# Altium project pikobasic_new.PrjPcb
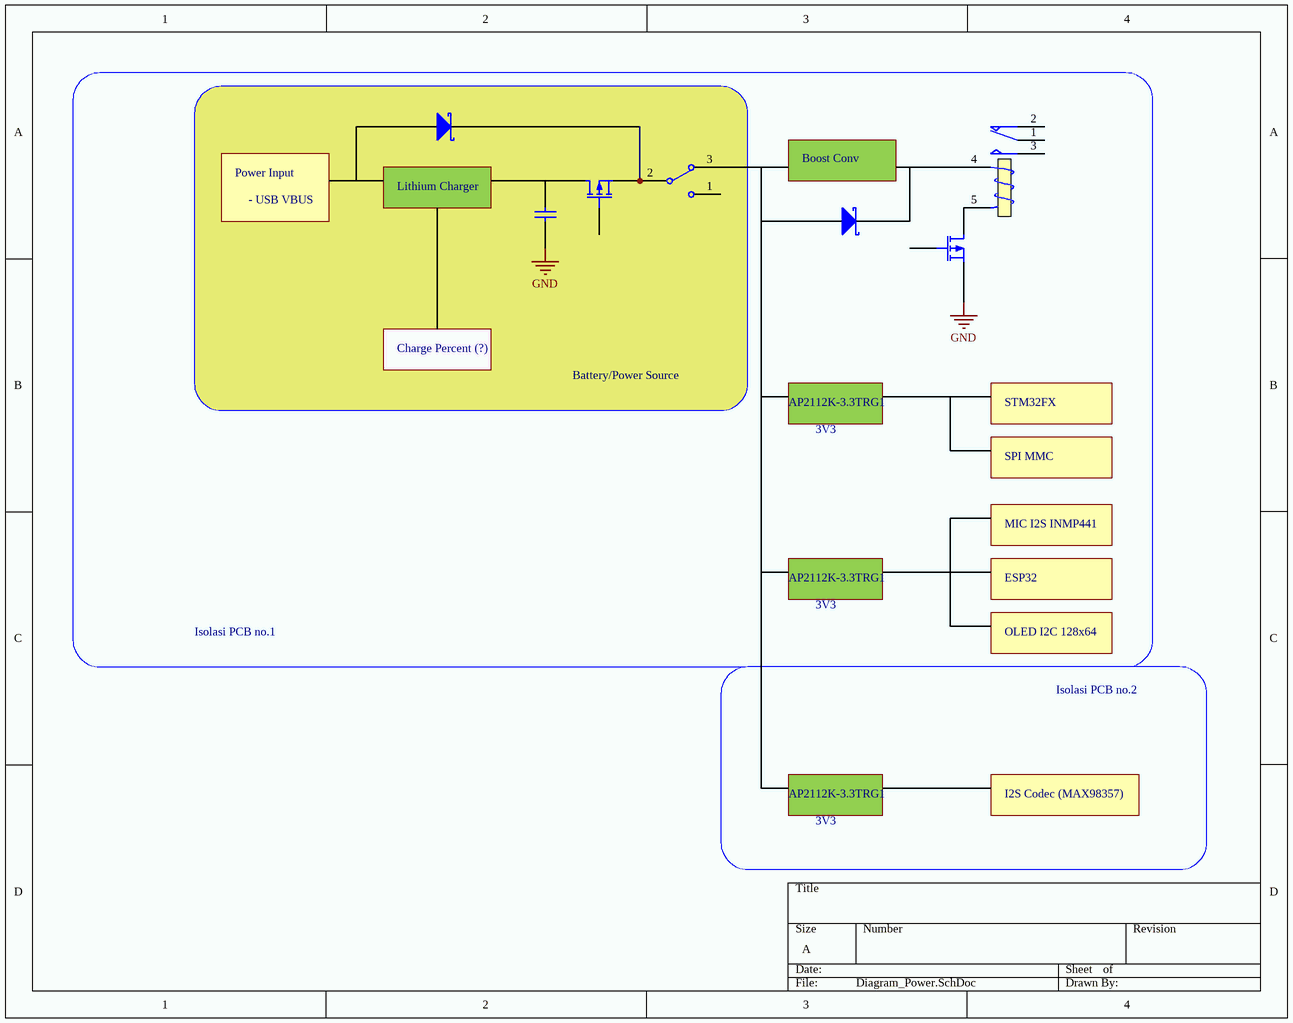
[diagram p0: Diagram_Power.SchDoc]
6 sheets, 186 parts. Net scope: global (net labels, ports and power ports of the same name join across sheets).
Sheets:
  Diagram_Power.SchDoc
  Diagram_Signal.SchDoc
  ESP32_EDITED.SchDoc
  STM32_EDITED.SchDoc
  DAC.SchDoc
  POWER_RAIL.SchDoc

## Sheet Diagram_Power.SchDoc
size A

### Parts
1  (no value)
2  (no value)
3  (no value)
4  (no value)
5  (no value)
7  (no value)
?  (no value)

### Nets
Net1_5: 1.5(T2) 5.1(D)
Net2_3: 2.3(S) 7.2

Not connected (* = marked no-connect by the designer): 1 1(COM) 2(NC) 3(NO) 4(T1); 2 1(D) 2(G); 3 1(A) 2(K); 4 1 2; 5 2(G) 3(S); 7 1 3; ? 1(A) 2(K)

### Notes on the sheet
- Boost Conv
- Power Input
- - USB VBUS
- Lithium Charger
- Charge Percent (?)
- Battery/Power Source
- AP2112K-3.3TRG1
- 3V3
- STM32FX
- SPI MMC
- MIC I2S INMP441
- Isolasi PCB no.1
- OLED I2C 128x64
- ESP32
- Isolasi PCB no.2
- I2S Codec (MAX98357)
- Labels drawn without touching a wire or pin: GND

### Library data of the parts
1 = Relay: Published: 8-Jun-2000; LatestRevisionDate: 17-Jul-2002; LatestRevisionNote: Re-released for DXP Platform.; PackageReference: MODULE5B; Publisher: Altium Limited
2 5 = MOSFET-P: P-Channel MOSFET; Published: 8-Jun-2000; LatestRevisionDate: 17-Jul-2002; LatestRevisionNote: Re-released for DXP Platform.; PackageVersion: 1995/1996; PackageReference: E3; Publisher: Altium Limited; PackageDescription: TO, Flat Index; 3 In-Line, Axial Leads; Body Dia. 4.6mm; Lead Dia. 0.5 mm (max)
3 ? = D Schottky: Schottky Diode; Published: 8-Jun-2000; LatestRevisionDate: 17-Jul-2002; LatestRevisionNote: Re-released for DXP Platform.; PackageReference: SMB; Publisher: Altium Limited; PackageDescription: DO-214-AA/SMB; 2 C-Bend Leads; Body 5.3 x 3.6 mm, inc. leads (LxW); Code_JEDEC: DO-214-AA
4 = Cap: Capacitor; Published: 8-Jun-2000; LatestRevisionDate: 17-Jul-2002; LatestRevisionNote: Re-released for DXP Platform.; PackageReference: RAD-0.3; Publisher: Altium Limited; PackageDescription: Radial Cap, Thru-Hole; 2 Leads; 0.3 in Pin Spacing
7 = SW-SPDT: SPDT Subminiature Toggle Switch, Right Angle Mounting, Vertical Actuation; Published: 24-Mar-1999; LatestRevisionDate: 17-Dec-2003; LatestRevisionNote: Schematic revised, PCB Footprint replaced.; DatasheetVersion: 05-Dec-2000; PackageReference: TL36WW15050; Publisher: Altium Limited; PackageDescription: Switch; 4 Leads; ComponentLink1Description: Manufacturer Link; ComponentLink1URL: http://www.apem.com

## Sheet Diagram_Signal.SchDoc
size A
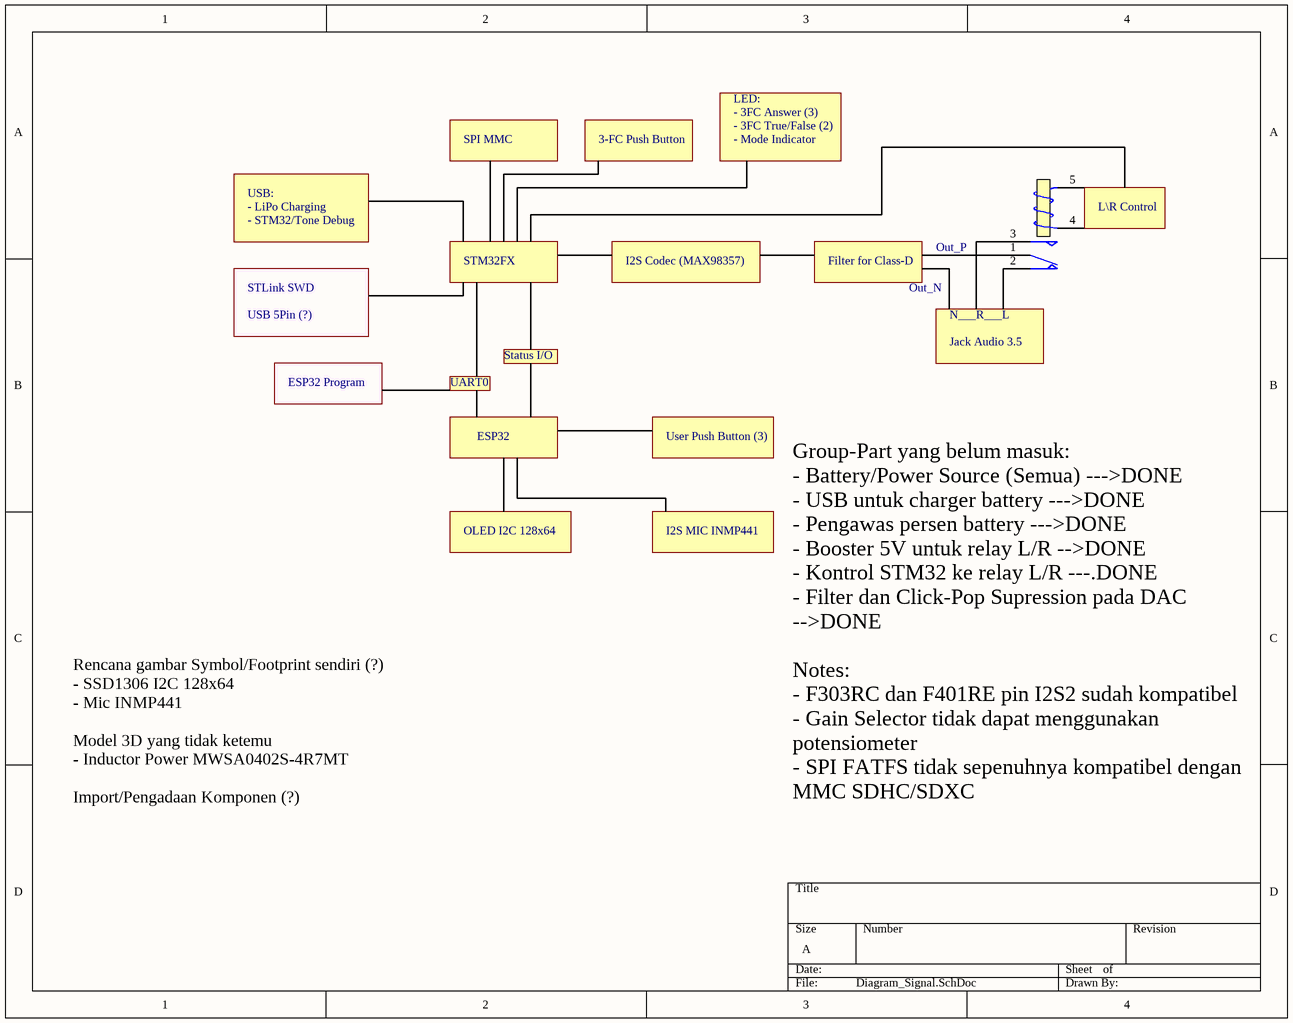
[diagram p1: Diagram_Signal.SchDoc]

### Parts
6  (no value)

### Nets

Not connected (* = marked no-connect by the designer): 6 1(COM) 2(NC) 3(NO) 4(T1) 5(T2)

### Notes on the sheet
- LED:
- SPI MMC
- 3-FC Push Button
- - 3FC Answer (3)
- - 3FC True/False (2)
- - Mode Indicator
- USB:
- - LiPo Charging
- - STM32/Tone Debug
- (near 6) L\R Control
- STLink SWD
- STM32FX
- I2S Codec (MAX98357)
- Filter for Class-D
- Out_N
- Out_P
- USB 5Pin (?)
- Status I/O
- Jack Audio 3.5
- (near 6) N___R___L
- ESP32 Program
- UART0
- ESP32
- User Push Button (3)
- OLED I2C 128x64
- I2S MIC INMP441
- Rencana gambar Symbol/Footprint sendiri (?)
  - SSD1306 I2C 128x64
  - Mic INMP441
  Model 3D yang tidak ketemu
  - Inductor Power MWSA0402S-4R7MT
  Import/Pengadaan Komponen (?)
- Group-Part yang belum masuk:
  - Battery/Power Source (Semua) --->DONE
  - USB untuk charger battery --->DONE
  - Pengawas persen battery --->DONE
  - Booster 5V untuk relay L/R -->DONE
  - Kontrol STM32 ke relay L/R ---.DONE
  - Filter dan Click-Pop Supression pada DAC -->DONE
  Notes:
  - F303RC dan F401RE pin I2S2 sudah kompatibel
  - Gain Selector tidak dapat menggunakan potensiometer
  - SPI FATFS tidak sepenuhnya kompatibel dengan MMC SDHC/SDXC

### Library data of the parts
6 = Relay: SPDT Relay; Published: 8-Jun-2000; LatestRevisionDate: 17-Jul-2002; LatestRevisionNote: Re-released for DXP Platform.; PackageReference: MODULE5B; Publisher: Altium Limited

## Sheet ESP32_EDITED.SchDoc
size A
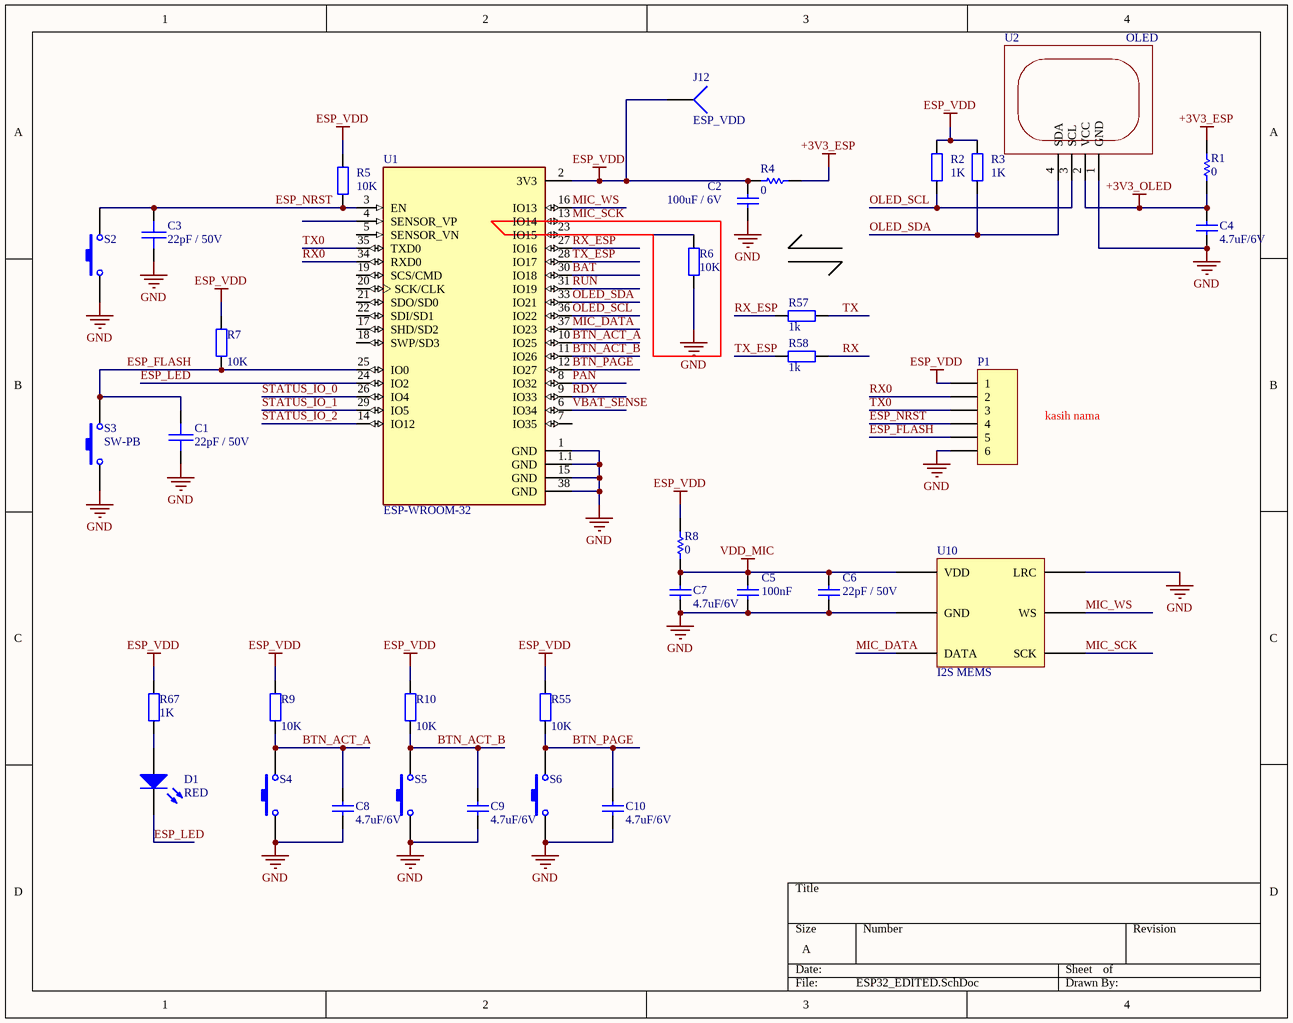
[diagram p2: ESP32_EDITED.SchDoc]

### Parts
C1  22pF / 50V  [CR2012-0805]
C2  100uF / 6V  [CR3216-1206]
C3  22pF / 50V  [CR2012-0805]
C4  4.7uF/6V  [CR2012-0805]
C5  100nF  [CR2012-0805]
C6  22pF / 50V  [CR2012-0805]
C7  4.7uF/6V  [CR2012-0805]
C8  4.7uF/6V  [CR2012-0805]
C9  4.7uF/6V  [CR2012-0805]
C10  4.7uF/6V  [CR2012-0805]
D1  RED  [LED1206]
J12  ESP_VDD  [PIN1]
P1  Header 6  [HDR1X6]  (value not drawn)
R1  0  [JP1_SMD]
R2  1K  [CR2012-0805]
R3  1K  [CR2012-0805]
R4  0  [JP1_SMD]
R5  10K  [CR2012-0805]
R6  10K  [CR2012-0805]
R7  10K  [CR2012-0805]
R8  0  [JP1_SMD]
R9  10K  [CR2012-0805]
R10  10K  [CR2012-0805]
R55  10K  [CR2012-0805]
R57  1k  [CR2012-0805]
R58  1k  [CR2012-0805]
R67  1K  [CR2012-0805]
S2  SW-PB  [pushbutton]  (value not drawn)
S3  SW-PB  [pushbutton]
S4  SW-PB  [pushbutton]  (value not drawn)
S5  SW-PB  [pushbutton]  (value not drawn)
S6  SW-PB  [pushbutton]  (value not drawn)
U1  ESP-WROOM-32  [MODULE_ESP-WROOM-32]
U2  OLED  [OLED_Display_1in6]
U10  I2S MEMS  [INMP441]

### Nets
+3V3_ESP: R1.2 R4.2
+3V3_OLED: C4.2 R1.1 U2.2(VCC)
ESP_VDD: C2.2 J12.1 P1.1 R2.2 R3.2 R4.1 R5.2 R7.2 R8.1 R9.2 R10.2 R55.2 R67.2 U1.2(3V3)
GND: C1.2 C2.1 C3.2 C4.1 C5.1 C6.1 C7.1 C8.1 C9.1 C10.1 P1.6 R6.2 S2.1 S3.1 S4.1 S5.1 S6.1 U1.1(GND) U1.1.1(GND) U1.15(GND) U1.38(GND) U2.1(GND) U10.3(LRC) U10.4(GND)
VDD_MIC: C5.2 C6.2 C7.2 R8.2 U10.5(VDD)
BAT: U1.30(IO18)
BTN_ACT_A: C8.2 R9.1 S4.2 U1.10(IO25)
BTN_ACT_B: C9.2 R10.1 S5.2 U1.11(IO26)
BTN_PAGE: C10.2 R55.1 S6.2 U1.12(IO27)
ESP_FLASH: C1.1 P1.5 R7.1 S3.2 U1.25(IO0)
ESP_LED: D1.K U1.24(IO2)
ESP_NRST: C3.1 P1.4 R5.1 S2.2 U1.3(EN)
MIC_DATA: U1.37(IO23) U10.6(DATA)
MIC_SCK: U1.13(IO14) U10.1(SCK)
MIC_WS: U1.16(IO13) U10.2(WS)
OLED_SCL: R2.1 U1.36(IO22) U2.3(SCL)
OLED_SDA: R3.1 U1.33(IO21) U2.4(SDA)
PAN: U1.8(IO32)
RDY: U1.9(IO33)
RUN: U1.31(IO19)
RX: R58.1
RX0: P1.2 U1.34(RXD0)
RX_ESP: R57.2 U1.27(IO16)
STATUS_IO_0: U1.26(IO4)
STATUS_IO_1: U1.29(IO5)
STATUS_IO_2: U1.14(IO12)
TX: R57.1
TX0: P1.3 U1.35(TXD0)
TX_ESP: R58.2 U1.28(IO17)
VBAT_SENSE: U1.6(IO34)
NetD1_A: D1.A R67.1
NetR6_1: R6.1 U1.23(IO15)

Not connected (* = marked no-connect by the designer): U1 4(SENSOR_VP) 5(SENSOR_VN) 7(IO35) 17(SHD/SD2) 18(SWP/SD3) 19(SCS/CMD) 20(SCK/CLK) 21(SDO/SD0) 22(SDI/SD1)

### Notes on the sheet
- kasih nama

### Library data of the parts
C1 C3 = SMT_C_0402: Surface mount capacitor 0402
C2 C5 C6 = Cap: Capacitor; Published: 8-Jun-2000; LatestRevisionDate: 17-Jul-2002; LatestRevisionNote: Re-released for DXP Platform.; PackageReference: RAD-0.3; Publisher: Altium Limited; PackageDescription: Radial Cap, Thru-Hole; 2 Leads; 0.3 in Pin Spacing
  C2: Value: 100uF / 6V
  C5: Value: 100nF
  C6: Value: 22pF / 50V
C4 C7-C10 = Cap Semi: Capacitor (Semiconductor SIM Model); Published: 8-Jun-2000; LatestRevisionDate: 29-May-2009; LatestRevisionNote: IPC-7351 Footprint Added.; PackageReference: C1206; Publisher: Altium Limited; PackageDescription: Chip Capacitor; Unit Price: 0.15; Value: 4.7uF/6V
D1 = LED2: Typical RED, GREEN, YELLOW, AMBER GaAs LED; Published: 8-Jun-2000; LatestRevisionDate: 17-Jul-2002; LatestRevisionNote: Re-released for DXP Platform.; PackageVersion: Feb-2002; PackageReference: 3.2X1.6X1.1; Publisher: Altium Limited; PackageDescription: SM LED; 2 Flat Leads
J12 = Socket: LatestRevisionDate: 17-Jul-2002; LatestRevisionNote: Re-released for DXP Platform.; Publisher: Altium Limited
P1 = Header 6: Header, 6-Pin; LatestRevisionDate: 17-Jul-2002; LatestRevisionNote: Re-released for DXP Platform.; Publisher: Altium Limited
R1 R4 R8 = Res Semi: Semiconductor Resistor; Published: 8-Jun-2000; LatestRevisionDate: 17-Jul-2002; LatestRevisionNote: Re-released for DXP Platform.; PackageReference: AXIAL-0.5; Publisher: Altium Limited; Unit Price: 0.15; Value: 0
R2 R3 R5-R7 R9 R10 R55 R57 R58 R67 = Res2: Resistor; Published: 8-Jun-2000; LatestRevisionDate: 17-Jul-2002; LatestRevisionNote: Re-released for DXP Platform.; PackageReference: AXIAL-0.4; Publisher: Altium Limited; PackageDescription: Axial Device, Thru-Hole; 2 Leads; 0.4 in Pin Spacing
  R2 R3 R67: Value: 1K
  R5-R7 R9 R10 R55: Value: 10K
  R57 R58: Value: 1k
S2 S4-S6 = SW-PB: Switch; Published: 24-Mar-1999; LatestRevisionDate: 17-Jul-2002; LatestRevisionNote: Re-released for DXP Platform.; PackageReference: SPST-2; Publisher: Altium Limited; PackageDescription: Switch; 2 Leads
S3 = pushbutton: Unit Price: 0.15
U1 = ESP-WROOM-32: WiFi 802.11b/g/n/d/e/i Transceiver Module 2.4GHz Surface Mount; MF: Olimex LTD; Value: *; SnapEDA_Link: https://www.snapeda.com/parts/ESP-WROOM-32/Olimex%20LTD/view-part/2311927/?ref=snap; MP: ESP-WROOM-32; Availability: Unavailable; Price: None; Package: Module Olimex LTD
U2 = OLED: I2C OLED 0.96"; Value: I2C OLED 0.96"
U10 = INMP441

## Sheet STM32_EDITED.SchDoc
size A4
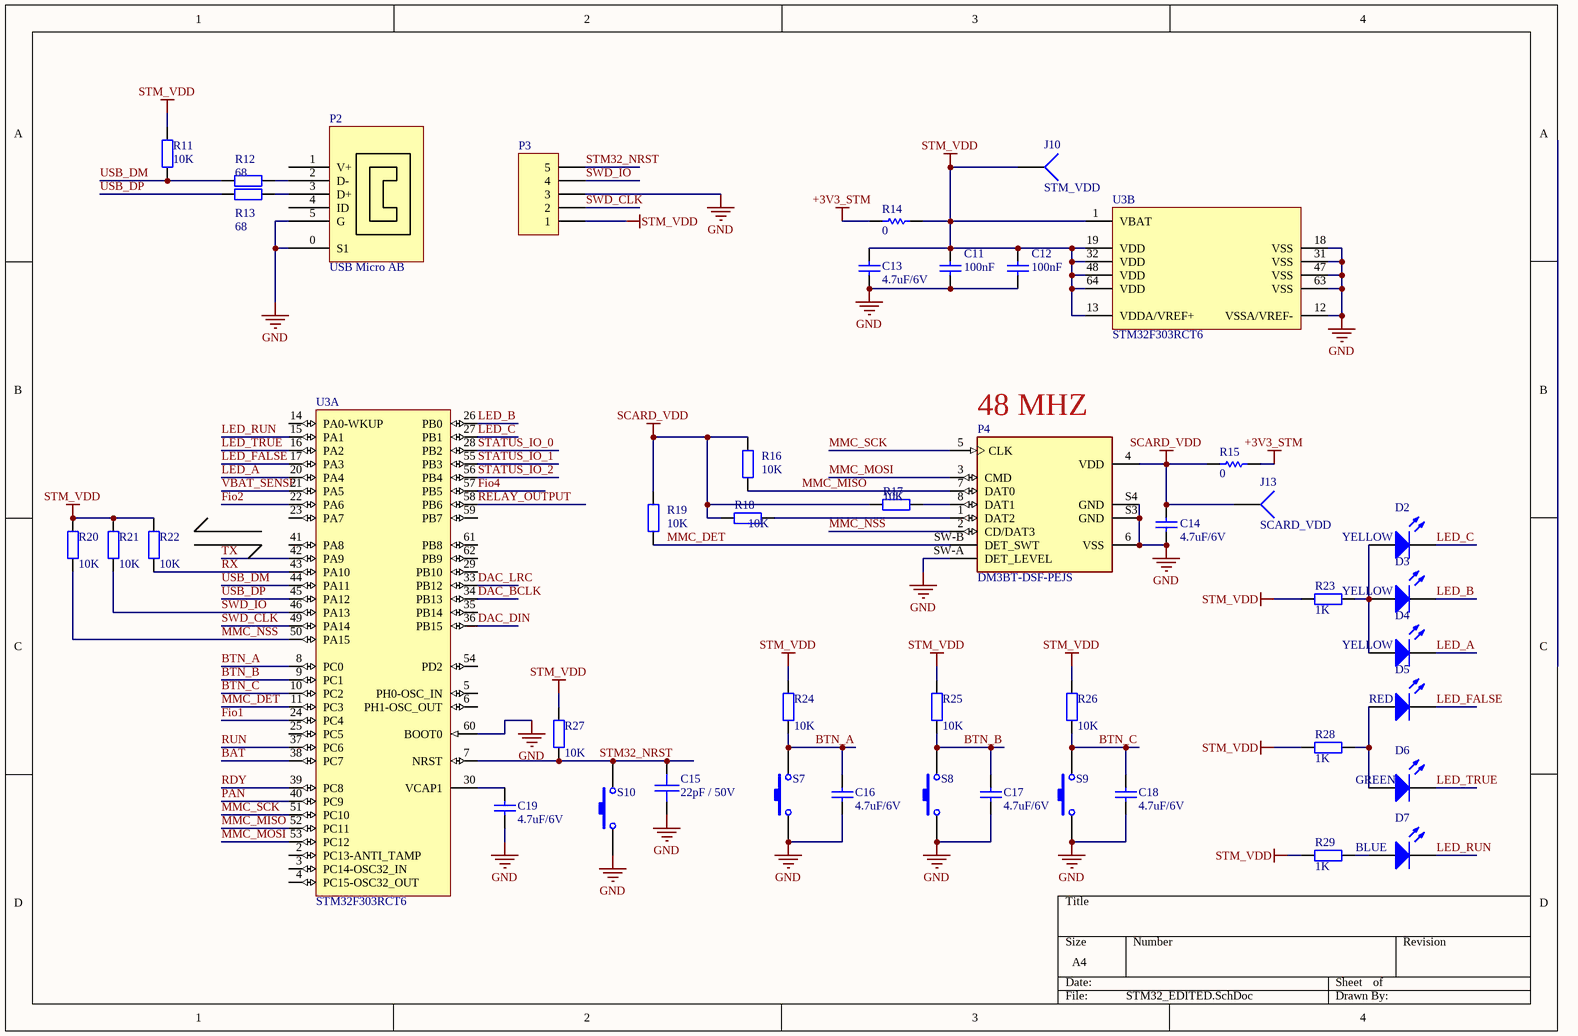
[diagram p3: STM32_EDITED.SchDoc]

### Parts
C11  100nF  [CR2012-0805]
C12  100nF  [CR2012-0805]
C13  4.7uF/6V  [CR2012-0805]
C14  4.7uF/6V  [CR2012-0805]
C15  22pF / 50V  [CR2012-0805]
C16  4.7uF/6V  [CR2012-0805]
C17  4.7uF/6V  [CR2012-0805]
C18  4.7uF/6V  [CR2012-0805]
C19  4.7uF/6V  [CR2012-0805]
D2  YELLOW  [LED1206]
D3  YELLOW  [LED1206]
D4  YELLOW  [LED1206]
D5  RED  [LED1206]
D6  GREEN  [LED1206]
D7  BLUE  [LED1206]
J10  STM_VDD  [PIN1]
J13  SCARD_VDD  [PIN1]
P2  USB Micro AB  [USB_MICRO_wi_LEG]
P3  SWD_STM32  [HDR1X5]  (value not drawn)
P4  DM3BT-DSF-PEJS  [HRS_DM3BT-DSF-PEJS]
R11  10K  [CR2012-0805]
R12  68  [CR2012-0805]
R13  68  [CR2012-0805]
R14  0  [JP1_SMD]
R15  0  [JP1_SMD]
R16  10K  [CR2012-0805]
R17  10K  [CR2012-0805]
R18  10K  [CR2012-0805]
R19  10K  [CR2012-0805]
R20  10K  [CR2012-0805]
R21  10K  [CR2012-0805]
R22  10K  [CR2012-0805]
R23  1K  [CR2012-0805]
R24  10K  [CR2012-0805]
R25  10K  [CR2012-0805]
R26  10K  [CR2012-0805]
R27  10K  [CR2012-0805]
R28  1K  [CR2012-0805]
R29  1K  [CR2012-0805]
S7  SW-PB  [pushbutton]  (value not drawn)
S8  SW-PB  [pushbutton]  (value not drawn)
S9  SW-PB  [pushbutton]  (value not drawn)
S10  SW-PB  [pushbutton]  (value not drawn)
U3  STM32F303RCT6  [STM-LQFP64_N]  (parts A,B of 2)

### Nets
+3V3_STM: R14.1 R15.1
GND: C11.1 C12.1 C13.1 C14.1 C15.2 C16.1 C17.1 C18.1 C19.1 P2.0(S1) P2.5(G) P3.3 P4.6(VSS) P4.S3(GND) P4.S4(GND) P4.SW-A(DET_LEVEL) S7.1 S8.1 S9.1 S10.1 U3.12(VSSA/VREF-) U3.18(VSS) U3.31(VSS) U3.47(VSS) U3.60(BOOT0) U3.63(VSS)
SCARD_VDD: C14.2 J13.1 P4.4(VDD) R15.2 R16.2 R17.1 R18.1 R19.2
STM_VDD: C11.2 C12.2 C13.2 J10.1 P3.1 R11.2 R14.2 R20.1 R21.1 R22.1 R23.2 R24.1 R25.1 R26.1 R27.2 R28.2 R29.2 U3.1(VBAT) U3.13(VDDA/VREF+) U3.19(VDD) U3.32(VDD) U3.48(VDD) U3.64(VDD)
BAT: U3.38(PC7)
BTN_A: C16.2 R24.2 S7.2 U3.8(PC0)
BTN_B: C17.2 R25.2 S8.2 U3.9(PC1)
BTN_C: C18.2 R26.2 S9.2 U3.10(PC2)
DAC_BCLK: U3.34(PB13)
DAC_DIN: U3.36(PB15)
DAC_LRC: U3.33(PB12)
Fio1: U3.24(PC4)
Fio2: U3.22(PA6)
Fio4: U3.57(PB5)
LED_A: D4.K U3.20(PA4)
LED_B: D3.K U3.26(PB0)
LED_C: D2.K U3.27(PB1)
LED_FALSE: D5.K U3.17(PA3)
LED_RUN: D7.K U3.15(PA1)
LED_TRUE: D6.K U3.16(PA2)
MMC_DET: P4.SW-B(DET_SWT) R19.1 U3.11(PC3)
MMC_MISO: P4.7(DAT0) R16.1 U3.52(PC11)
MMC_MOSI: P4.3(CMD) U3.53(PC12)
MMC_NSS: P4.2(CD/DAT3) R20.2 U3.50(PA15)
MMC_SCK: P4.5(CLK) U3.51(PC10)
PAN: U3.40(PC9)
RDY: U3.39(PC8)
RELAY_OUTPUT: U3.58(PB6)
RUN: U3.37(PC6)
RX: R22.2 U3.43(PA10)
STATUS_IO_0: U3.28(PB2)
STATUS_IO_1: U3.55(PB3)
STATUS_IO_2: U3.56(PB4)
STM32_NRST: C15.1 P3.5 R27.1 S10.2 U3.7(NRST)
SWD_CLK: P3.2 U3.49(PA14)
SWD_IO: P3.4 R21.2 U3.46(PA13)
TX: U3.42(PA9)
USB_DM: R11.1 R12.1 U3.44(PA11)
USB_DP: R13.1 U3.45(PA12)
VBAT_SENSE: U3.21(PA5)
NetC19_2: C19.2 U3.30(VCAP1)
NetD2_A: D2.A D3.A D4.A R23.1
NetD5_A: D5.A D6.A R28.1
NetD7_A: D7.A R29.1
NetP2_2: P2.2(D-) R12.2
NetP2_3: P2.3(D+) R13.2
NetP4_1: P4.1(DAT2) R18.2
NetP4_8: P4.8(DAT1) R17.2

Not connected (* = marked no-connect by the designer): P2 1(V+) 4(ID); U3 2(PC13-ANTI_TAMP) 3(PC14-OSC32_IN) 4(PC15-OSC32_OUT) 5(PH0-OSC_IN) 6(PH1-OSC_OUT) 14(PA0-WKUP) 23(PA7) 25(PC5) 29(PB10) 35(PB14) 41(PA8) 54(PD2) 59(PB7) 61(PB8) 62(PB9)

### Notes on the sheet
- (near P4) 48 MHZ

### Library data of the parts
C11 C12 C14 = Cap: Capacitor; Published: 8-Jun-2000; LatestRevisionDate: 17-Jul-2002; LatestRevisionNote: Re-released for DXP Platform.; PackageReference: RAD-0.3; Publisher: Altium Limited; PackageDescription: Radial Cap, Thru-Hole; 2 Leads; 0.3 in Pin Spacing
  C11 C12: Value: 100nF
  C14: Value: 4.7uF/6V
C13 C16-C19 = Cap Semi: Capacitor (Semiconductor SIM Model); Published: 8-Jun-2000; LatestRevisionDate: 29-May-2009; LatestRevisionNote: IPC-7351 Footprint Added.; PackageReference: C1206; Publisher: Altium Limited; PackageDescription: Chip Capacitor; Unit Price: 0.15; Value: 4.7uF/6V
C15 = SMT_C_0402: Surface mount capacitor 0402
D2-D7 = LED0: Typical INFRARED GaAs LED; Published: 8-Jun-2000; LatestRevisionDate: 08-Jul-2005; LatestRevisionNote: Mech Layer 1 removed.; PackageReference: LED-0; Publisher: Altium Limited; PackageDescription: LED; 2 Leads
J10 J13 = Socket: LatestRevisionDate: 17-Jul-2002; LatestRevisionNote: Re-released for DXP Platform.; Publisher: Altium Limited
P2 = USB Micro AB: USB Micro AB connector
P3 = Header 5: Header, 5-Pin; LatestRevisionDate: 17-Jul-2002; LatestRevisionNote: Re-released for DXP Platform.; Publisher: Altium Limited
P4 = DM3BT-DSF-PEJS: 10 _8 + 2_ microSDâ„¢ Surface Mount, Right Angle Gold; MP: 502570-0893; MF: Molex; Price: None; Package: None; Value: *; Availability: Unavailable; SnapEDA_Link: https://www.snapeda.com/parts/502570-0893/Molex/view-part/225170/?ref=snap
R11-R13 R16-R29 = Res2: Resistor; Published: 8-Jun-2000; LatestRevisionDate: 17-Jul-2002; LatestRevisionNote: Re-released for DXP Platform.; PackageReference: AXIAL-0.4; Publisher: Altium Limited; PackageDescription: Axial Device, Thru-Hole; 2 Leads; 0.4 in Pin Spacing
  R11 R16-R22 R24-R27: Value: 10K
  R12 R13: Value: 68
  R23 R28 R29: Value: 1K
R14 R15 = Res Semi: Semiconductor Resistor; Published: 8-Jun-2000; LatestRevisionDate: 17-Jul-2002; LatestRevisionNote: Re-released for DXP Platform.; PackageReference: AXIAL-0.5; Publisher: Altium Limited; Unit Price: 0.15; Value: 0
S7-S10 = SW-PB: Switch; Published: 24-Mar-1999; LatestRevisionDate: 17-Jul-2002; LatestRevisionNote: Re-released for DXP Platform.; PackageReference: SPST-2; Publisher: Altium Limited; PackageDescription: Switch; 2 Leads
U3 = STM32F401RCT6: ARM Cortex-M4 32-bit MCU+FPU, 105 DMIPS, 256 kB Flash, 64 kB Internal RAM, 48 I/Os, 64-pin LQFP, -40 to 85 degC, Tray; Manufacturer: STMicroelectronics; FLASH Size (Prog) (kB): 256; I/Os (High Current): 48; Internal RAM Size (kB): 64; Operating Frequency(F) (Processor speed) (MHz): 84; Supply Voltage(Vcc) max (V): 3.6; Supply Voltage(Vcc) min (V): 1.8; DatasheetVersion: Rev. 1; PackageVersion: Rev. 4, 06/2013; PackageReference: LQFP64; PackageDescription: 64-Pin Low Profile Quad Flat Package, 10 x 10 mm Body, 0.5 mm Pitch; Supplier 1: Digi-Key; Supplier Part Number 1: 497-14047-ND; Supplier 2: Newark; Supplier Part Number 2: 19X6221; Supplier 3: Mouser; Supplier Part Number 3: 511-STM32F401RCT6; Core: ARM Cortex-M4; Packing: Tray; Mounting Technology: Surface Mount; PartNumber: STM32F401RCT6; ComponentLink1Description: Manufacturer URL; ComponentLink1URL: http://www.st.com/web/en/home.html; ComponentLink2Description: Datasheet; ComponentLink2URL: http://www.st.com/st-web-ui/static/active/en/resource/technical/document/data_brief/DM00071938.pdf; ComponentLink3Description: Package Specification; ComponentLink3URL: http://www.st.com/st-web-ui/static/active/en/resource/technical/document/datasheet/DM00037051.pdf

## Sheet DAC.SchDoc
size A4
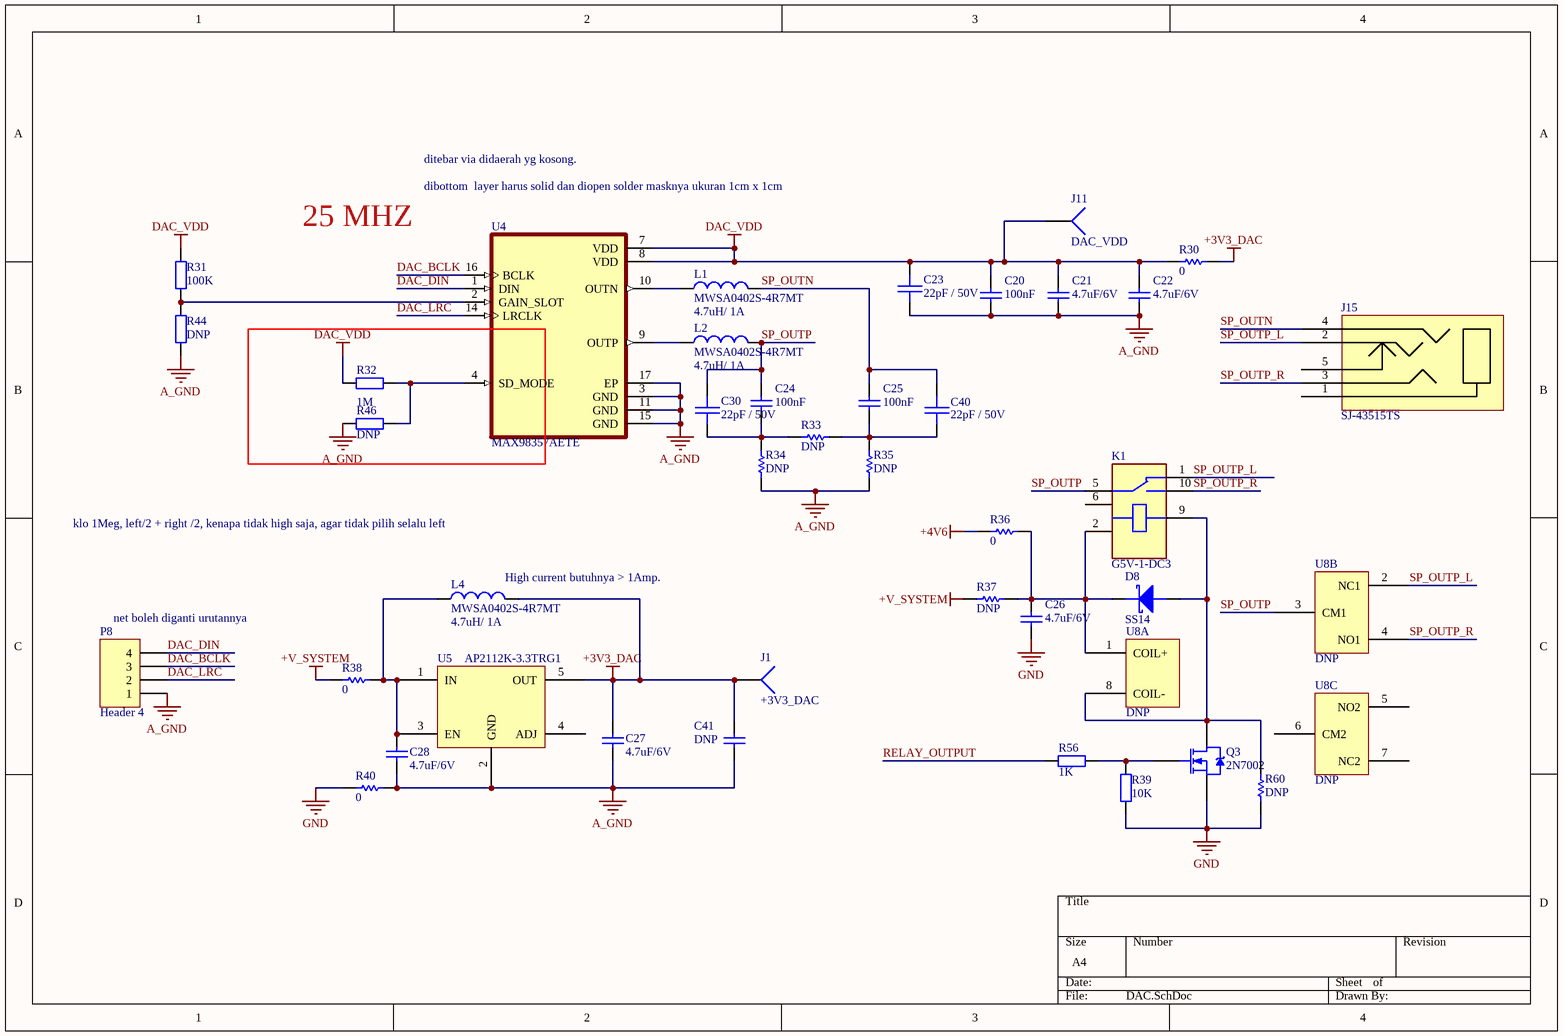
[diagram p4: DAC.SchDoc]

### Parts
C20  100nF  [CR2012-0805]
C21  4.7uF/6V  [CR2012-0805]
C22  4.7uF/6V  [CR2012-0805]
C23  22pF / 50V  [CR2012-0805]
C24  100nF  [CR2012-0805]
C25  100nF  [CR2012-0805]
C26  4.7uF/6V  [CR2012-0805]
C27  4.7uF/6V  [CR2012-0805]
C28  4.7uF/6V  [CR2012-0805]
C30  22pF / 50V  [CR2012-0805]
C40  22pF / 50V  [CR2012-0805]
C41  DNP  [CR2012-0805]
D8  SS14  [DO-214AC (SMA)]
J1  +3V3_DAC  [PIN1]
J11  DAC_VDD  [PIN1]
J15  SJ-43515TS  [SJ-435116]
K1  G5V-1-DC3  [RELAY_G5V-1-DC5]
L1  MWSA0402S-4R7MT  value 4.7uH/ 1A  [IND4X4MM]
L2  MWSA0402S-4R7MT  value 4.7uH/ 1A  [IND4X4MM]
L4  MWSA0402S-4R7MT  value 4.7uH/ 1A  [IND4X4MM]
P8  Header 4  [HDR1X4]
Q3  2N7002  [SOT-23/F2]
R30  0  [JP1_SMD]
R31  100K  [JP2_SMD]
R32  1M  [JP2_SMD]
R33  DNP  [JP2_SMD]
R34  DNP  [JP2_SMD]
R35  DNP  [JP2_SMD]
R36  0  [JP1_SMD]
R37  DNP  [JP1_SMD]
R38  0  [JP1_SMD]
R39  10K  [CR2012-0805]
R40  0  [JP1_SMD]
R44  DNP  [JP2_SMD]
R46  DNP  [JP2_SMD]
R56  1K  [CR2012-0805]
R60  DNP  [JP1_SMD]
U4  MAX98357AETE  [QFN50P300X300X80-17N]
U5  AP2112K-3.3TRG1  [SOT-23-5]
U8  DNP  [EC2-5NU]  (parts A,B,C of 3)

### Nets
+3V3_DAC: C27.2 C41.2 J1.1 L4.2 R30.2 U5.5(OUT)
+4V6: R36.1
+V_SYSTEM: R37.1 R38.1
A_GND: C20.1 C21.1 C22.1 C23.2 C27.1 C28.1 C41.1 P8.1 R34.1 R35.1 R40.2 R44.1 R46.2 U4.3(GND) U4.11(GND) U4.15(GND) U4.17(EP) U5.2(GND)
DAC_VDD: C20.2 C21.2 C22.2 C23.1 J11.1 R30.1 R31.2 R32.1 U4.7(VDD) U4.8(VDD)
GND: C26.1 Q3.S R39.1 R40.1 R60.1
DAC_BCLK: P8.3 U4.16(BCLK)
DAC_DIN: P8.4 U4.1(DIN)
DAC_LRC: P8.2 U4.14(LRCLK)
RELAY_OUTPUT: R56.2
SP_OUTN: C25.2 C40.1 J15.4 L1.2
SP_OUTP: C24.2 C30.1 K1.5(COM) L2.2 U8.3(CM1)
SP_OUTP_L: J15.2 K1.1(NC) U8.2(NC1)
SP_OUTP_R: J15.3 K1.10(NO) U8.4(NO1)
NetC24_1: C24.1 C30.2 R33.1 R34.2
NetC25_1: C25.1 C40.2 R33.2 R35.2
NetC26_2: C26.2 D8.2(K) K1.2(C1) R36.2 R37.2 U8.1(COIL+)
NetC28_2: C28.2 L4.1 R38.2 U5.1(IN) U5.3(EN)
NetD8_1: D8.1(A) K1.9(C2) Q3.D R60.2 U8.8(COIL-)
NetL1_1: L1.1 U4.10(OUTN)
NetL2_1: L2.1 U4.9(OUTP)
NetQ3_G: Q3.G R39.2 R56.1
NetR31_1: R31.1 R44.2 U4.2(GAIN_SLOT)
NetR32_2: R32.2 R46.1 U4.4(SD_MODE)

Not connected (* = marked no-connect by the designer): J15 1 5; K1 6(COM); U5 4(ADJ); U8 5(NO2) 6(CM2) 7(NC2)

### Notes on the sheet
- ditebar via didaerah yg kosong.
- 25 MHZ
- dibottom  layer harus solid dan diopen solder masknya ukuran 1cm x 1cm
- klo 1Meg, left/2 + right /2, kenapa tidak high saja, agar tidak pilih selalu left
- (near L4) High current butuhnya > 1Amp.
- (near P8) net boleh diganti urutannya

### Library data of the parts
C20-C22 C24-C26 C41 = Cap: Capacitor; Published: 8-Jun-2000; LatestRevisionDate: 17-Jul-2002; LatestRevisionNote: Re-released for DXP Platform.; PackageReference: RAD-0.3; Publisher: Altium Limited; PackageDescription: Radial Cap, Thru-Hole; 2 Leads; 0.3 in Pin Spacing
  C20 C24 C25: Value: 100nF
  C21 C22 C26: Value: 4.7uF/6V
  C41: Value: DNP
C23 C30 C40 = SMT_C_0402: Surface mount capacitor 0402
C27 C28 = Cap Semi: Capacitor (Semiconductor SIM Model); Published: 8-Jun-2000; LatestRevisionDate: 29-May-2009; LatestRevisionNote: IPC-7351 Footprint Added.; PackageReference: C1206; Publisher: Altium Limited; PackageDescription: Chip Capacitor; Unit Price: 0.15; Value: 4.7uF/6V
D8 = DIODE SCHOTTKY: Schottky Barrier Diodes; Manufacturer Part Number: SS18; Package / Case: SMA (DO-214AC)
J1 J11 = Socket: LatestRevisionDate: 17-Jul-2002; LatestRevisionNote: Re-released for DXP Platform.; Publisher: Altium Limited
J15 = SJ-43515TS: SJ-43515TS 3.5 MM AUDIO JACK
K1 = G5V-1-DC5: General Purpose Relay SPDT _1 Form C_ Through Hole; MF: Omron Electronics; Package: None; Value: *; Price: None; MP: G5V-1-DC5; Availability: Unavailable; SnapEDA_Link: https://www.snapeda.com/parts/G5V-1-DC5/Omron%20Electronics%20Inc-EMC%20Div/view-part/125140/?ref=snap
L1 L2 L4 = Inductor: Code_IEC: 1005; Published: 8-Jun-2000; LatestRevisionDate: 29-May-2009; LatestRevisionNote: IPC-7351 Footprint Added.; PackageReference: 0402-A; Publisher: Altium Limited; PackageDescription: Chip Inductor; Code_JEITA: 0402
P8 = Header 4: Header, 4-Pin; LatestRevisionDate: 17-Jul-2002; LatestRevisionNote: Re-released for DXP Platform.; Publisher: Altium Limited
Q3 = NMOS_GENERIC_SOT23: N CHANNEL MOSFET GENERIC SCH LIB; Part Number: 2N7002ET1G; Manufacturer: ON Semiconductor; Unit Price: 0.28; Category: Discrete Semiconductor Products; Manufacturer Part Number: 2N7002ET1G; Supplier: Digi-Key; Supplier Part Number: 2N7002ET1GOSDKR-ND
R30 R33-R38 R40 R60 = Res Semi: Semiconductor Resistor; Published: 8-Jun-2000; LatestRevisionDate: 17-Jul-2002; LatestRevisionNote: Re-released for DXP Platform.; PackageReference: AXIAL-0.5; Publisher: Altium Limited; Unit Price: 0.15
  R30 R36 R38 R40: Value: 0
  R33-R35 R37 R60: Value: DNP
R31 R32 R39 R44 R46 R56 = Res2: Resistor; Published: 8-Jun-2000; LatestRevisionDate: 17-Jul-2002; LatestRevisionNote: Re-released for DXP Platform.; PackageReference: AXIAL-0.4; Publisher: Altium Limited; PackageDescription: Axial Device, Thru-Hole; 2 Leads; 0.4 in Pin Spacing
  R31: Value: 100K
  R32: Value: 1M
  R39: Value: 10K
  R44 R46: Value: DNP
  R56: Value: 1K
U4 = MAX98357AETE: Audio Amp Speaker 1-CH Mono 3.2W Class-D 16-Pin TQFN EP T/R; MF: Maxim Integrated; SnapEDA_Link: https://www.snapeda.com/parts/MAX98357AETE/Maxim+Integrated/view-part/?ref=snap; MP: MAX98357AETE; Check_prices: https://www.snapeda.com/parts/MAX98357AETE/Maxim+Integrated/view-part/?ref=eda; Price: None; Purchase-URL: https://pricing.snapeda.com/search/part/MAX98357AETE/?ref=eda; Availability: In Stock; Value: *; Package: None
U5 = AP7311: IC REG LDO ADJ .15A SOT25-5; Manufacturer: Diodes Inc; Current - Limit (Min): 200mA; Number of Regulators: 1; Current - Output: 150mA (Max); Voltage - Input: 2 V ~ 6 V; Voltage - Output: 1.8V; Regulator Topology: Positive Fixed; Supplier Device Package: SOT-25; Package / Case: SC-74A, SOT-753; Mounting Type: Surface Mount; Operating Temperature: -40°C ~ 85°C; Category: Integrated Circuits (ICs); Voltage - Dropout (Typical): -; Supplier: Digi-Key; Packaging: Cut Tape (CT); RoHS: RoHS Compliant; Supplier Part Number: AP7311-18WG-7DICT-ND; ComponentLink1URL: http://www.diodes.com/datasheets/AP7311.pdf; ComponentLink1Description: http://www.diodes.com/datasheets/AP7311.pdf; Pricing: 1=0.5, 10=0.394, 25=0.3324, 100=0.2708, 250=0.22424, 500=0.18526, 1000=0.13875 (USD); Stock: 7183; Manufacturer Part Number: AP2112K-3.3TRG1
U8 = EC2-5NU: EC2-5NU Miniature Signal Relays 4 Volt Control

## Sheet POWER_RAIL.SchDoc
size A3
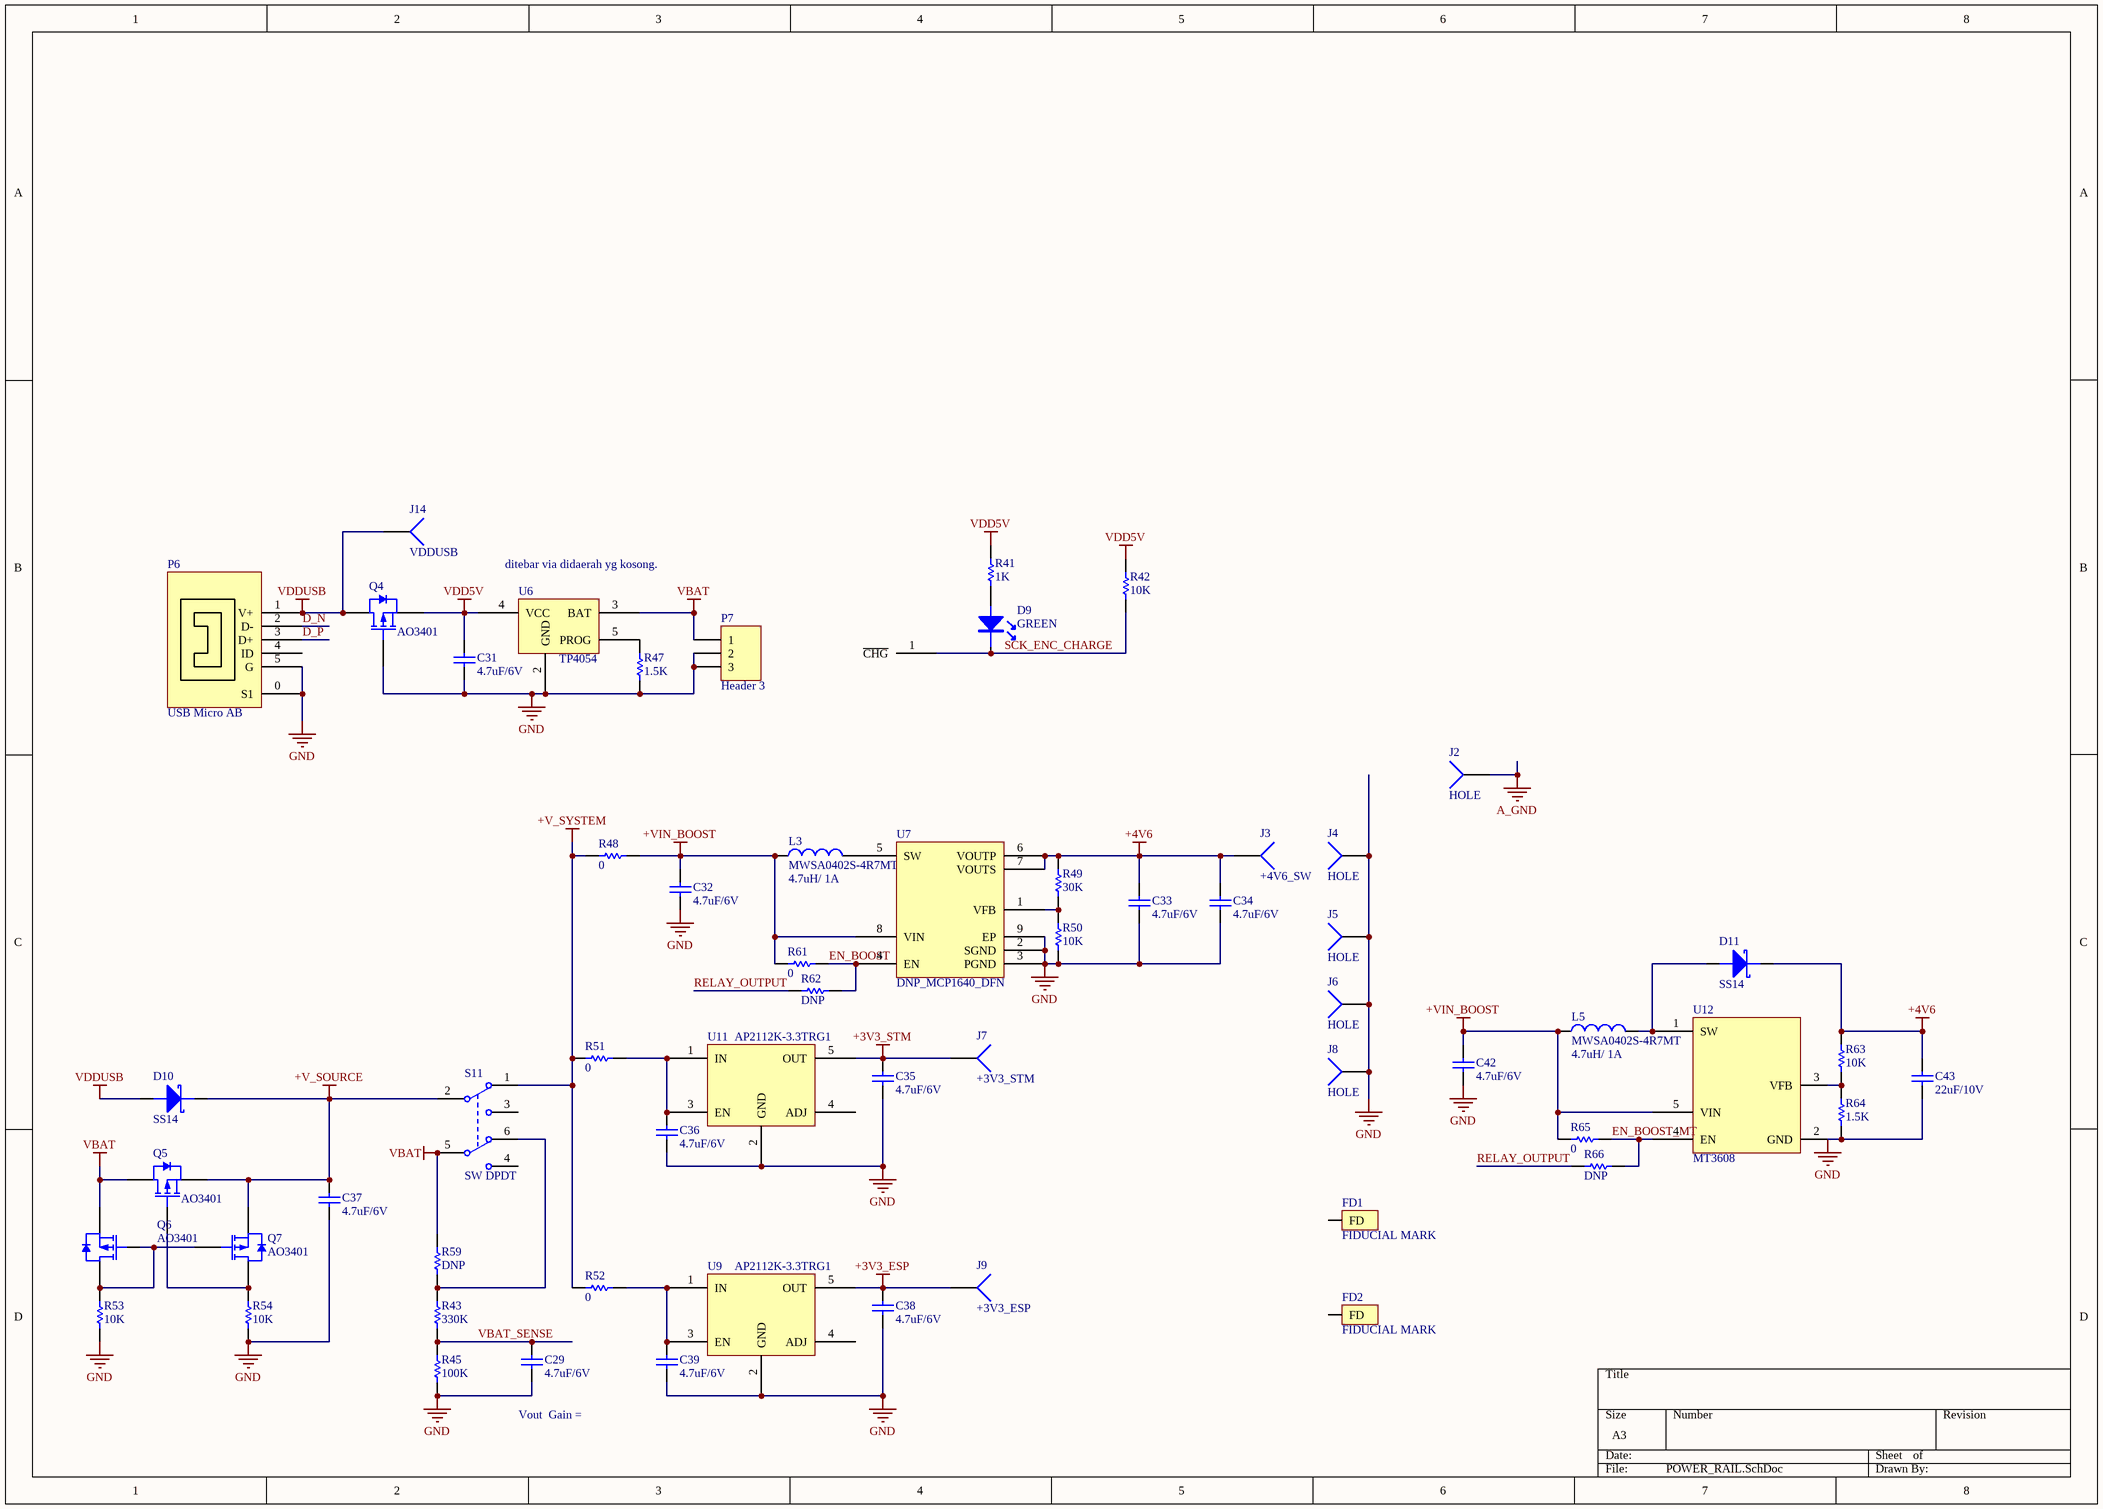
[diagram p5: POWER_RAIL.SchDoc]

### Parts
C29  4.7uF/6V  [CR2012-0805]
C31  4.7uF/6V  [CR2012-0805]
C32  4.7uF/6V  [CR2012-0805]
C33  4.7uF/6V  [CR2012-0805]
C34  4.7uF/6V  [CR2012-0805]
C35  4.7uF/6V  [CR2012-0805]
C36  4.7uF/6V  [CR2012-0805]
C37  4.7uF/6V  [CR2012-0805]
C38  4.7uF/6V  [CR2012-0805]
C39  4.7uF/6V  [CR2012-0805]
C42  4.7uF/6V  [CR2012-0805]
C43  22uF/10V  [CR3216-1206]
D9  GREEN  [LED1206]
D10  SS14  [DO-214AC (SMA)]
D11  SS14  [DO-214AC (SMA)]
FD1  FIDUCIAL MARK  [FIDU-ROUND]
FD2  FIDUCIAL MARK  [FIDU-ROUND]
J2  HOLE  [HOLE_45MM]
J3  +4V6_SW  [PIN1]
J4  HOLE  [HOLE_45MM]
J5  HOLE  [HOLE_45MM]
J6  HOLE  [HOLE_45MM]
J7  +3V3_STM  [PIN1]
J8  HOLE  [HOLE_45MM]
J9  +3V3_ESP  [PIN1]
J14  VDDUSB  [PIN1]
L3  MWSA0402S-4R7MT  value 4.7uH/ 1A  [IND4X4MM]
L5  MWSA0402S-4R7MT  value 4.7uH/ 1A  [IND4X4MM]
P6  USB Micro AB  [USB_MICRO_wi_LEG]
P7  Header 3  [Molex 3p Male]
Q4  AO3401  [SOT-23-3]
Q5  AO3401  [SOT-23-3]
Q6  AO3401  [SOT-23-3]
Q7  AO3401  [SOT-23-3]
R41  1K  [CR2012-0805]
R42  10K  [CR2012-0805]
R43  330K  [CR2012-0805]
R45  100K  [CR2012-0805]
R47  1.5K  [CR2012-0805]
R48  0  [JP1_SMD]
R49  30K  [CR2012-0805]
R50  10K  [CR2012-0805]
R51  0  [JP1_SMD]
R52  0  [JP1_SMD]
R53  10K  [CR2012-0805]
R54  10K  [CR2012-0805]
R59  DNP  [JP1_SMD]
R61  0  [JP1_SMD]
R62  DNP  [JP1_SMD]
R63  10K  [CR2012-0805]
R64  1.5K  [CR2012-0805]
R65  0  [JP1_SMD]
R66  DNP  [JP1_SMD]
S11  SW DPDT  [SWITCH_SPDT]
U6  TP4054  [SOT23-5]
U7  DNP_MCP1640_DFN  [DFN-8_2X3]
U9  AP2112K-3.3TRG1  [SOT-23-5]
U11  AP2112K-3.3TRG1  [SOT-23-5]
U12  MT3608  [SOT-23-6]

### Nets
+3V3_ESP: C38.2 J9.1 U9.5(OUT)
+3V3_STM: C35.2 J7.1 U11.5(OUT)
+4V6: C33.2 C34.2 C43.2 D11.2(K) J3.1 R49.2 R63.2 U7.6(VOUTP) U7.7(VOUTS)
+V_SOURCE: C37.2 D10.2(K) Q5.2(S) Q7.2(S) S11.2(COMMON1)
+V_SYSTEM: R48.1 R51.1 R52.1 S11.1(NC1)
+VIN_BOOST: C32.2 C42.2 L3.1 L5.1 R48.2 R61.1 R65.1 U7.8(VIN) U12.5(VIN)
A_GND: J2.1
GND: C29.1 C31.1 C32.1 C33.1 C34.1 C35.1 C36.1 C37.1 C38.1 C39.1 C42.1 C43.1 J4.1 J5.1 J6.1 J8.1 P6.0(S1) P6.5(G) P7.2 P7.3 Q4.1(G) R45.1 R47.1 R50.1 R53.1 R54.1 R64.1 U6.2(GND) U7.2(SGND) U7.3(PGND) U7.9(EP) U9.2(GND) U11.2(GND) U12.2(GND)
VBAT: P7.1 Q5.3(D) Q6.2(S) R59.2 S11.5(COMMON2) U6.3(BAT)
VDD5V: C31.2 Q4.2(S) R41.2 R42.2 U6.4(VCC)
VDDUSB: D10.1(A) J14.1 P6.1(V+) Q4.3(D)
D_N: P6.2(D-)
D_P: P6.3(D+)
EN_BOOST: R61.2 R62.1 U7.4(EN)
EN_BOOST_MT: R65.2 R66.1 U12.4(EN)
RELAY_OUTPUT: R62.2 R66.2
SCK_ENC_CHARGE: D9.K R42.1 U6.1(~{CHG})
VBAT_SENSE: C29.2 R43.1 R45.2
NetC36_2: C36.2 R51.2 U11.1(IN) U11.3(EN)
NetC39_2: C39.2 R52.2 U9.1(IN) U9.3(EN)
NetD9_A: D9.A R41.1
NetD11_1: D11.1(A) L5.2 U12.1(SW)
NetL3_2: L3.2 U7.5(SW)
NetQ5_1: Q5.1(G) Q7.3(D) R54.2
NetQ6_1: Q6.1(G) Q6.3(D) Q7.1(G) R53.2
NetR43_2: R43.2 R59.1 S11.6(NO2)
NetR47_2: R47.2 U6.5(PROG)
NetR49_1: R49.1 R50.2 U7.1(VFB)
NetR63_1: R63.1 R64.2 U12.3(VFB)

Not connected (* = marked no-connect by the designer): FD1 1(FD); FD2 1(FD); P6 4(ID); S11 3(NO1) 4(NC2); U9 4(ADJ); U11 4(ADJ)

### Notes on the sheet
- (near U6) ditebar via didaerah yg kosong.
- (near C29) Vout  Gain =

### Library data of the parts
C29 C31-C39 C42 C43 = Cap Semi: Capacitor (Semiconductor SIM Model); Published: 8-Jun-2000; LatestRevisionDate: 29-May-2009; LatestRevisionNote: IPC-7351 Footprint Added.; PackageReference: C1206; Publisher: Altium Limited; PackageDescription: Chip Capacitor; Unit Price: 0.15
  C29 C31-C39 C42: Value: 4.7uF/6V
  C43: Value: 22uF/10V
D9 = SMT_LED_0603: SMT LED
D10 D11 = DIODE SCHOTTKY: as D8 on sheet DAC; Package / Case: SMA (DO-214AC)
FD1 FD2 = FIDU: 0.5mm fiducial marking with 1mm solder expansion
J2-J9 J14 = Socket: LatestRevisionDate: 17-Jul-2002; LatestRevisionNote: Re-released for DXP Platform.; Publisher: Altium Limited
L3 L5 = Inductor: Code_IEC: 1005; Published: 8-Jun-2000; LatestRevisionDate: 29-May-2009; LatestRevisionNote: IPC-7351 Footprint Added.; PackageReference: 0402-A; Publisher: Altium Limited; PackageDescription: Chip Inductor; Code_JEITA: 0402
P6 = USB Micro AB: USB Micro AB connector
P7 = Header 3: Header, 3-Pin; LatestRevisionDate: 17-Jul-2002; LatestRevisionNote: Re-released for DXP Platform.; Publisher: Altium Limited
Q4-Q7 = AO3401: 30V P-Channel MOSFET; Published: 17-Sep-2003; PackageVersion: May-1999; PackageReference: SOT23; Publisher: Altium Limited; PackageDescription: 3-Pin SOT-23 Package 0.95 mm Pitch, 2.3 mm Lead Span
R41 R42 R48-R54 R59 R61-R66 = Res Semi: Semiconductor Resistor; Published: 8-Jun-2000; LatestRevisionDate: 17-Jul-2002; LatestRevisionNote: Re-released for DXP Platform.; PackageReference: AXIAL-0.5; Publisher: Altium Limited; Unit Price: 0.15
  R41: Value: 1K
  R42 R50 R53 R54 R63: Value: 10K
  R48 R51 R52 R61 R65: Value: 0
  R49: Value: 30K
  R59 R62 R66: Value: DNP
  R64: Value: 1.5K
R43 R45 = Res Semi: Semiconductor Resistor; Value: 56K; Published: 8-Jun-2000; LatestRevisionDate: 17-Jul-2002; LatestRevisionNote: Re-released for DXP Platform.; PackageReference: AXIAL-0.5; Publisher: Altium Limited; Unit Price: 0.15
R47 = Res Semi: Semiconductor Resistor; Value: 1.6K; Published: 8-Jun-2000; LatestRevisionDate: 17-Jul-2002; LatestRevisionNote: Re-released for DXP Platform.; PackageReference: AXIAL-0.5; Publisher: Altium Limited; Unit Price: 0.15
S11 = SW DPDT: Switch; Published: 24-Mar-1999; LatestRevisionDate: 29-May-2009; LatestRevisionNote: IPC-7351 Footprint Added.; PackageVersion: Mar-2001; PackageReference: SOT23-6; Publisher: Altium Limited; PackageDescription: 6-Pin SOT-23 Package 0.95 mm Pitch, 2.7 mm Lead Span; Code_JEITA: SC-74; Code_IPC: SOT26A-6
U6 = TP4056
U7 = MCP1640_DFN: Synchronous Boost Regulator with True Output Disconnect or Input/Output Bypass Option
U9 U11 = AP7311: IC REG LDO ADJ .15A SOT25-5; Manufacturer: Diodes Inc; Manufacturer Part Number: AP7311-18WG-7; Current - Limit (Min): 200mA; Number of Regulators: 1; Current - Output: 150mA (Max); Voltage - Input: 2 V ~ 6 V; Voltage - Output: 1.8V; Regulator Topology: Positive Fixed; Supplier Device Package: SOT-25; Package / Case: SC-74A, SOT-753; Mounting Type: Surface Mount; Operating Temperature: -40°C ~ 85°C; Category: Integrated Circuits (ICs); Voltage - Dropout (Typical): -; Supplier: Digi-Key; Packaging: Cut Tape (CT); RoHS: RoHS Compliant; Supplier Part Number: AP2112K-3.3TRG1; ComponentLink1URL: http://www.diodes.com/datasheets/AP7311.pdf; ComponentLink1Description: http://www.diodes.com/datasheets/AP7311.pdf; Pricing: 1=0.5, 10=0.394, 25=0.3324, 100=0.2708, 250=0.22424, 500=0.18526, 1000=0.13875 (USD); Stock: 7183
U12 = MT3608: Synchronous Boost Regulator with True Output Disconnect or Input/Output Bypass Option

## Nets that join several sheets
+3V3_ESP: ESP32_EDITED (R1.2 R4.2), POWER_RAIL (C38.2 J9.1 U9.5)
+3V3_STM: STM32_EDITED (R14.1 R15.1), POWER_RAIL (C35.2 J7.1 U11.5)
+4V6: DAC (R36.1), POWER_RAIL (9 pins)
+V_SYSTEM: DAC (R37.1 R38.1), POWER_RAIL (R48.1 R51.1 R52.1 S11.1)
A_GND: DAC (18 pins), POWER_RAIL (J2.1)
GND: ESP32_EDITED (24 pins), STM32_EDITED (26 pins), DAC (5 pins), POWER_RAIL (34 pins)
BAT: ESP32_EDITED (U1.30), STM32_EDITED (U3.38)
DAC_BCLK: STM32_EDITED (U3.34), DAC (P8.3 U4.16)
DAC_DIN: STM32_EDITED (U3.36), DAC (P8.4 U4.1)
DAC_LRC: STM32_EDITED (U3.33), DAC (P8.2 U4.14)
PAN: ESP32_EDITED (U1.8), STM32_EDITED (U3.40)
RDY: ESP32_EDITED (U1.9), STM32_EDITED (U3.39)
RELAY_OUTPUT: STM32_EDITED (U3.58), DAC (R56.2), POWER_RAIL (R62.2 R66.2)
RUN: ESP32_EDITED (U1.31), STM32_EDITED (U3.37)
RX: ESP32_EDITED (R58.1), STM32_EDITED (R22.2 U3.43)
STATUS_IO_0: ESP32_EDITED (U1.26), STM32_EDITED (U3.28)
STATUS_IO_1: ESP32_EDITED (U1.29), STM32_EDITED (U3.55)
STATUS_IO_2: ESP32_EDITED (U1.14), STM32_EDITED (U3.56)
TX: ESP32_EDITED (R57.1), STM32_EDITED (U3.42)
VBAT_SENSE: ESP32_EDITED (U1.6), STM32_EDITED (U3.21), POWER_RAIL (C29.2 R43.1 R45.2)